# Altium schematic sheet 30B Main Power.SchDoc
size 420 x 297 mm
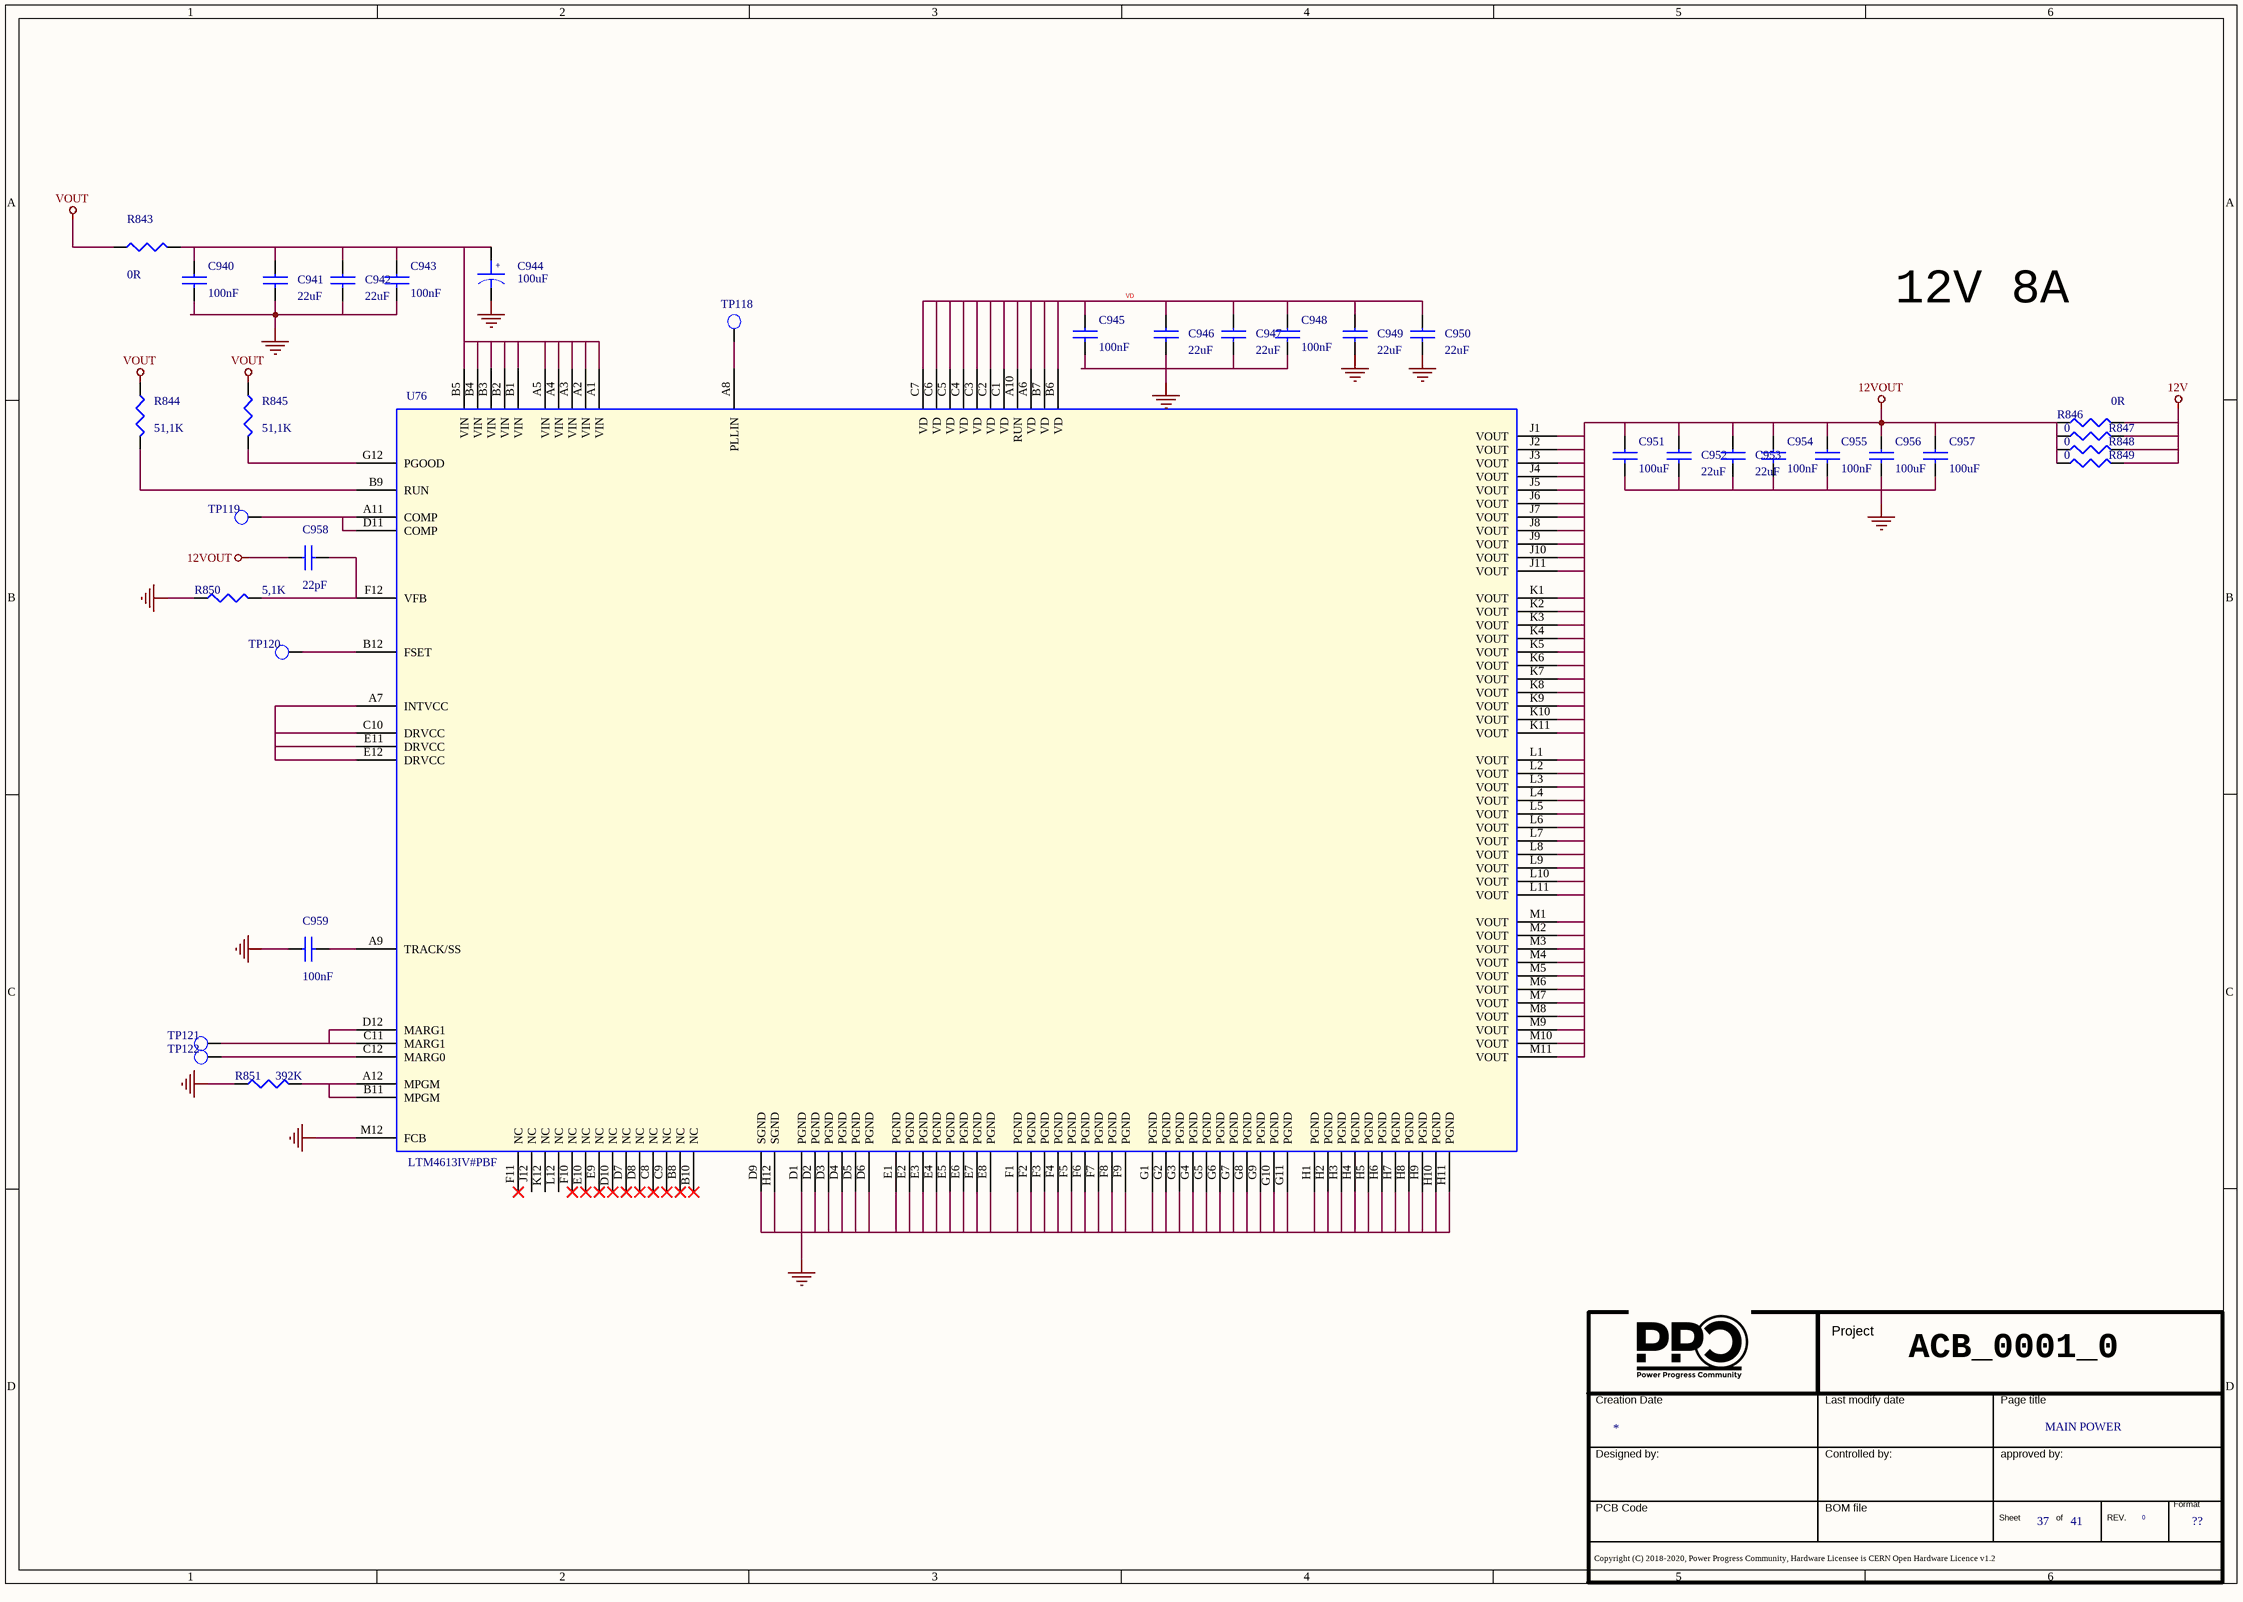
[diagram p0: 30B Main Power.SchDoc]

## Parts
*  Doc: MAIN POWER  Page Count: 41  Page Number: 37  Page Size: ??  RevCode: 0  (hidden comment: Title_block_PPC)  (graphical)
C940  100nF  [SMD_0402]
C941  22uF  [SMD_0805]
C942  22uF  [SMD_0805]
C943  100nF  [SMD_0402]
C944  100uF  [SMD_6.3X6.3x6.1]
C945  100nF  [SMD_0402]
C946  22uF  [SMD_0805]
C947  22uF  [SMD_0805]
C948  100nF  [SMD_0402]
C949  22uF  [SMD_0805]
C950  22uF  [SMD_0805]
C951  100uF  [SMD_1210]
C952  22uF  [SMD_0805]
C953  22uF  [SMD_0805]
C954  100nF  [SMD_0402]
C955  100nF  [SMD_0402]
C956  100uF  [SMD_1210]
C957  100uF  [SMD_1210]
C958  22pF  [SMD_0402]
C959  100nF  [SMD_0402]
R843  0R  [SMD_2512]
R844  51,1K  [SMD_0402]
R845  51,1K  [SMD_0402]
R846  0R  [SMD_2512]
R847  0  [SMD_1206]
R848  0  [SMD_1206]
R849  0  [SMD_1206]
R850  5,1K  [SMD_0402]
R851  392K  [SMD_0402]
TP118  TEST POINT  [PCB]  (value not drawn)
TP119  TEST POINT  [PCB]  (value not drawn)
TP120  TEST POINT  [PCB]  (value not drawn)
TP121  TEST POINT  [PCB]  (value not drawn)
TP122  TEST POINT  [PCB]  (value not drawn)
U76  LTM4613IV#PBF  [LGA-133]

## Nets
12V: R846.2 R847.1 R848.1 R849.1
12VOUT: C951.1 C952.1 C953.1 C954.1 C955.1 C956.1 C957.1 C958.1 R846.1 R847.2 R848.2 R849.2 U76.J1(VOUT) U76.J2(VOUT) U76.J3(VOUT) U76.J4(VOUT) U76.J5(VOUT) U76.J6(VOUT) U76.J7(VOUT) U76.J8(VOUT) U76.J9(VOUT) U76.J10(VOUT) U76.J11(VOUT) U76.K1(VOUT) U76.K2(VOUT) U76.K3(VOUT) U76.K4(VOUT) U76.K5(VOUT) U76.K6(VOUT) U76.K7(VOUT) U76.K8(VOUT) U76.K9(VOUT) U76.K10(VOUT) U76.K11(VOUT) U76.L1(VOUT) U76.L2(VOUT) U76.L3(VOUT) U76.L4(VOUT) U76.L5(VOUT) U76.L6(VOUT) U76.L7(VOUT) U76.L8(VOUT) U76.L9(VOUT) U76.L10(VOUT) U76.L11(VOUT) U76.M1(VOUT) U76.M2(VOUT) U76.M3(VOUT) U76.M4(VOUT) U76.M5(VOUT) U76.M6(VOUT) U76.M7(VOUT) U76.M8(VOUT) U76.M9(VOUT) U76.M10(VOUT) U76.M11(VOUT)
GND: C940.2 C941.2 C942.2 C943.2 C944.2 C945.2 C946.2 C947.2 C948.2 C949.2 C950.2 C956.2 C959.1 R850.1 R851.1 U76.D1(PGND) U76.D2(PGND) U76.D3(PGND) U76.D4(PGND) U76.D5(PGND) U76.D6(PGND) U76.D9(SGND) U76.E1(PGND) U76.E2(PGND) U76.E3(PGND) U76.E4(PGND) U76.E5(PGND) U76.E6(PGND) U76.E7(PGND) U76.E8(PGND) U76.F1(PGND) U76.F2(PGND) U76.F3(PGND) U76.F4(PGND) U76.F5(PGND) U76.F6(PGND) U76.F7(PGND) U76.F8(PGND) U76.F9(PGND) U76.G1(PGND) U76.G2(PGND) U76.G3(PGND) U76.G4(PGND) U76.G5(PGND) U76.G6(PGND) U76.G7(PGND) U76.G8(PGND) U76.G9(PGND) U76.G10(PGND) U76.G11(PGND) U76.H1(PGND) U76.H2(PGND) U76.H3(PGND) U76.H4(PGND) U76.H5(PGND) U76.H6(PGND) U76.H7(PGND) U76.H8(PGND) U76.H9(PGND) U76.H10(PGND) U76.H11(PGND) U76.H12(SGND) U76.M12(FCB)
VOUT: R843.1 R844.1 R845.1
VD: C945.1 C946.1 C947.1 C948.1 C949.1 C950.1 U76.A6(VD) U76.A10(RUN) U76.B6(VD) U76.B7(VD) U76.C1(VD) U76.C2(VD) U76.C3(VD) U76.C4(VD) U76.C5(VD) U76.C6(VD) U76.C7(VD)
NetC940_1: C940.1 C941.1 C942.1 C943.1 C944.1 R843.2 U76.A1(VIN) U76.A2(VIN) U76.A3(VIN) U76.A4(VIN) U76.A5(VIN) U76.B1(VIN) U76.B2(VIN) U76.B3(VIN) U76.B4(VIN) U76.B5(VIN)
NetC951_2: C951.2 C952.2 C953.2 C954.2 C955.2 C957.2
NetC958_2: C958.2 R850.2 U76.F12(VFB)
NetC959_2: C959.2 U76.A9(TRACK/SS)
NetR844_2: R844.2 U76.B9(RUN)
NetR845_2: R845.2 U76.G12(PGOOD)
NetR851_2: R851.2 U76.A12(MPGM) U76.B11(MPGM)
NetTP118_1: TP118.1(TP) U76.A8(PLLIN)
NetTP119_1: TP119.1(TP) U76.A11(COMP) U76.D11(COMP)
NetTP120_1: TP120.1(TP) U76.B12(FSET)
NetTP121_1: TP121.1(TP) U76.C11(MARG1) U76.D12(MARG1)
NetTP122_1: TP122.1(TP) U76.C12(MARG0)
NetU76_A7: U76.A7(INTVCC) U76.C10(DRVCC) U76.E11(DRVCC) U76.E12(DRVCC)

Not connected (* = marked no-connect by the designer): U76 B8(NC)* B10(NC)* C8(NC)* C9(NC)* D7(NC)* D8(NC)* D10(NC)* E9(NC)* E10(NC)* F10(NC)* F11(NC)* J12(NC) K12(NC) L12(NC)

## Notes on the sheet
- 12V 8A
- ACB_0001_0
- (in symbol CAP POL) +
- (in symbol Title_block_PPC) Project; Creation Date; Last modify date; Page title; Designed by:; Controlled by:; approved by:; Format; PCB Code; BOM file; Sheet; of; REV.; Copyright (C) 2018-2020, Power Progress Community, Hardware Licensee is CERN Open Hardware Licence v1.2

## Library data of the parts
* = Title_block_PPC: Title: PORTATILE ACUBE; Schematic Page Count: 45; Author: MICETEK; Page Create Date: March  8, 1995; Page Title: ?; Page Modify Date: *; Schematic Page Number: 41
C940 C943 C945 C948 = CAP NP_Dup9: COND.CER. 100NF 50V 0402 X7R SMD; Manufacturer Part Number 1: CGA2B3X7R1H104M050BD; Manufacturer 1: TDK; Part Number: PASSIVE_24; RSM: RC0402; PCB Footprint: SMD_0402; Distributor 1: DIGKEY (445-9694-2-ND); Part Type: Capacitors\Ceramic\SMD\0402
C941 C942 C946 C947 C949 C950 C952 C953 = CAP NP_Dup2: 22UF 35V 20% 0805; Part Number: PASSIVE_224; Manufacturer 1: TDK; Manufacturer Part Number 1: C2012X5R1V226M125AC; RSM: RC0805; Part Type: Capacitors\Ceramic\SMD\0805; PCB Footprint: SMD_0805
C944 = CAP POL: CAP ALUM 100UF 35V 20% SMD; Part Number: PASSIVE_1410; Manufacturer 1: PANASONIC; Manufacturer Part Number 1: EEE-FT1V101AP; RSM: CE-6_3X6_3; PCB Footprint: SMD_6.3X6.3x6.1; Part Type: Capacitors\Aluminium\SMD
C951 = CAP NP_Dup9: CAP CER 100UF 16V 20% X5R 1210; Part Number: PASSIVE_264; Manufacturer 1: Taiyo Yuden; Manufacturer Part Number 1: EMK325ABJ107MM-T; RSM: RC1210; PCB Footprint: SMD_1210; Part Type: Capacitors\Ceramic\SMD\1210; Distributor 1: DIGIKEY (587-3152-2-ND)
C954 C955 = CAP NP_Dup9: COND.CER. 100NF 50V 0402 X7R SMD; Part Number: PASSIVE_24; Manufacturer 1: TDK; Manufacturer Part Number 1: CGA2B3X7R1H104M050BD; RSM: RC0402; PCB Footprint: SMD_0402; Part Type: Capacitors\Ceramic\SMD\0402; Distributor 1: DIGKEY (445-9694-2-ND)
C956 C957 = CAP NP_Dup2: CAP CER 100UF 16V 20% X5R 1210; Manufacturer Part Number 1: EMK325ABJ107MM-T; Manufacturer 1: Taiyo Yuden; Part Number: PASSIVE_264; RSM: RC1210; PCB Footprint: SMD_1210; Part Type: Capacitors\Ceramic\SMD\1210
C958 = CAP NP_Dup2: COND.CER. 22PF 50V 0402 NPO 5% SMD; Manufacturer Part Number 1: GRM1555C1H220JZ01; Manufacturer 1: Murata; Part Number: PASSIVE_65; RSM: RC0402; PCB Footprint: SMD_0402; Part Type: Capacitors\Ceramic\SMD\0402
C959 = CAP NP_Dup2: COND.CER. 100NF 50V 0402 X7R SMD; Manufacturer Part Number 1: CGA2B3X7R1H104M050BD; Manufacturer 1: TDK; Part Number: PASSIVE_24; RSM: RC0402; PCB Footprint: SMD_0402; Part Type: Capacitors\Ceramic\SMD\0402
R843 R846 = R_Dup8: Thick Film Resistors 0OHM 1WATT 5%; Manufacturer Part Number 1: CR2512-J/-000ELF; Manufacturer 1: bourns; Part Number: PASSIVE_1318; RSM: RC2512; PCB Footprint: SMD_2512; Distributor 1: MOUSER(652-CR2512-J/-000ELF); Part Type: Resistors\Fixed\SMD\2512\1%
R844 R845 = R_Dup5: RESIS.CHIP 51K1 1% 0402 SMD; Part Number: PASSIVE_748; Manufacturer 1: ROYAL OHM; Manufacturer Part Number 1: CAMEL ELETTRONICA SRL  #; RSM: RC0402; PCB Footprint: SMD_0402; Part Type: Resistors\Fixed\SMD\0402\1%
R847-R849 = R_Dup5: RESIS. 0R 1/4W 1206 SMD E96; Manufacturer Part Number 1: CR32000ZL; Manufacturer 1: ASJ; Part Number: PASSIVE_1266; RSM: RC1206; PCB Footprint: SMD_1206; Part Type: Resistors\Fixed\SMD\1206\5%
R850 = R_Dup5: RES SMD 5.1K OHM 1% 1/16W 0402; Part Number: PASSIVE_742; Manufacturer 1: YAGEO; Manufacturer Part Number 1: RC0402FR-075K1L; RSM: RC0402; PCB Footprint: SMD_0402; Part Type: Resistors\Fixed\SMD\0402\1%
R851 = R_Dup5: RES 392K OHM 1/10W 1% 0402 SMD; Manufacturer Part Number 1: CRCW0402392KFKED; Manufacturer 1: Vishay; Part Number: PASSIVE_713; RSM: RC0402; PCB Footprint: SMD_0402; Part Type: Resistors\Fixed\SMD\0402\1%
TP118-TP122 = T POINT R: TEST POINT SU PCB; Part Number: CONNECTORS_542; RSM: AE-TESTPOINT; PCB Footprint: PCB; Part Type: Tpoint
U76 = LTM4613: Ultralow EMI, 36V, 8A Step-down Module; Manufacturer 1: ANALOG; Part Number: LINEAR_324; RSM: LGA-133-15X15; Distributor 1: MOUSER(584-LTM4613IV#PBF); Manufacturer Part Number 1: LTM4613IV#PBF; Part Type: Regulators\MODULE; PCB Footprint: LGA-133